# Altium project Power-Monitor.PrjPcb
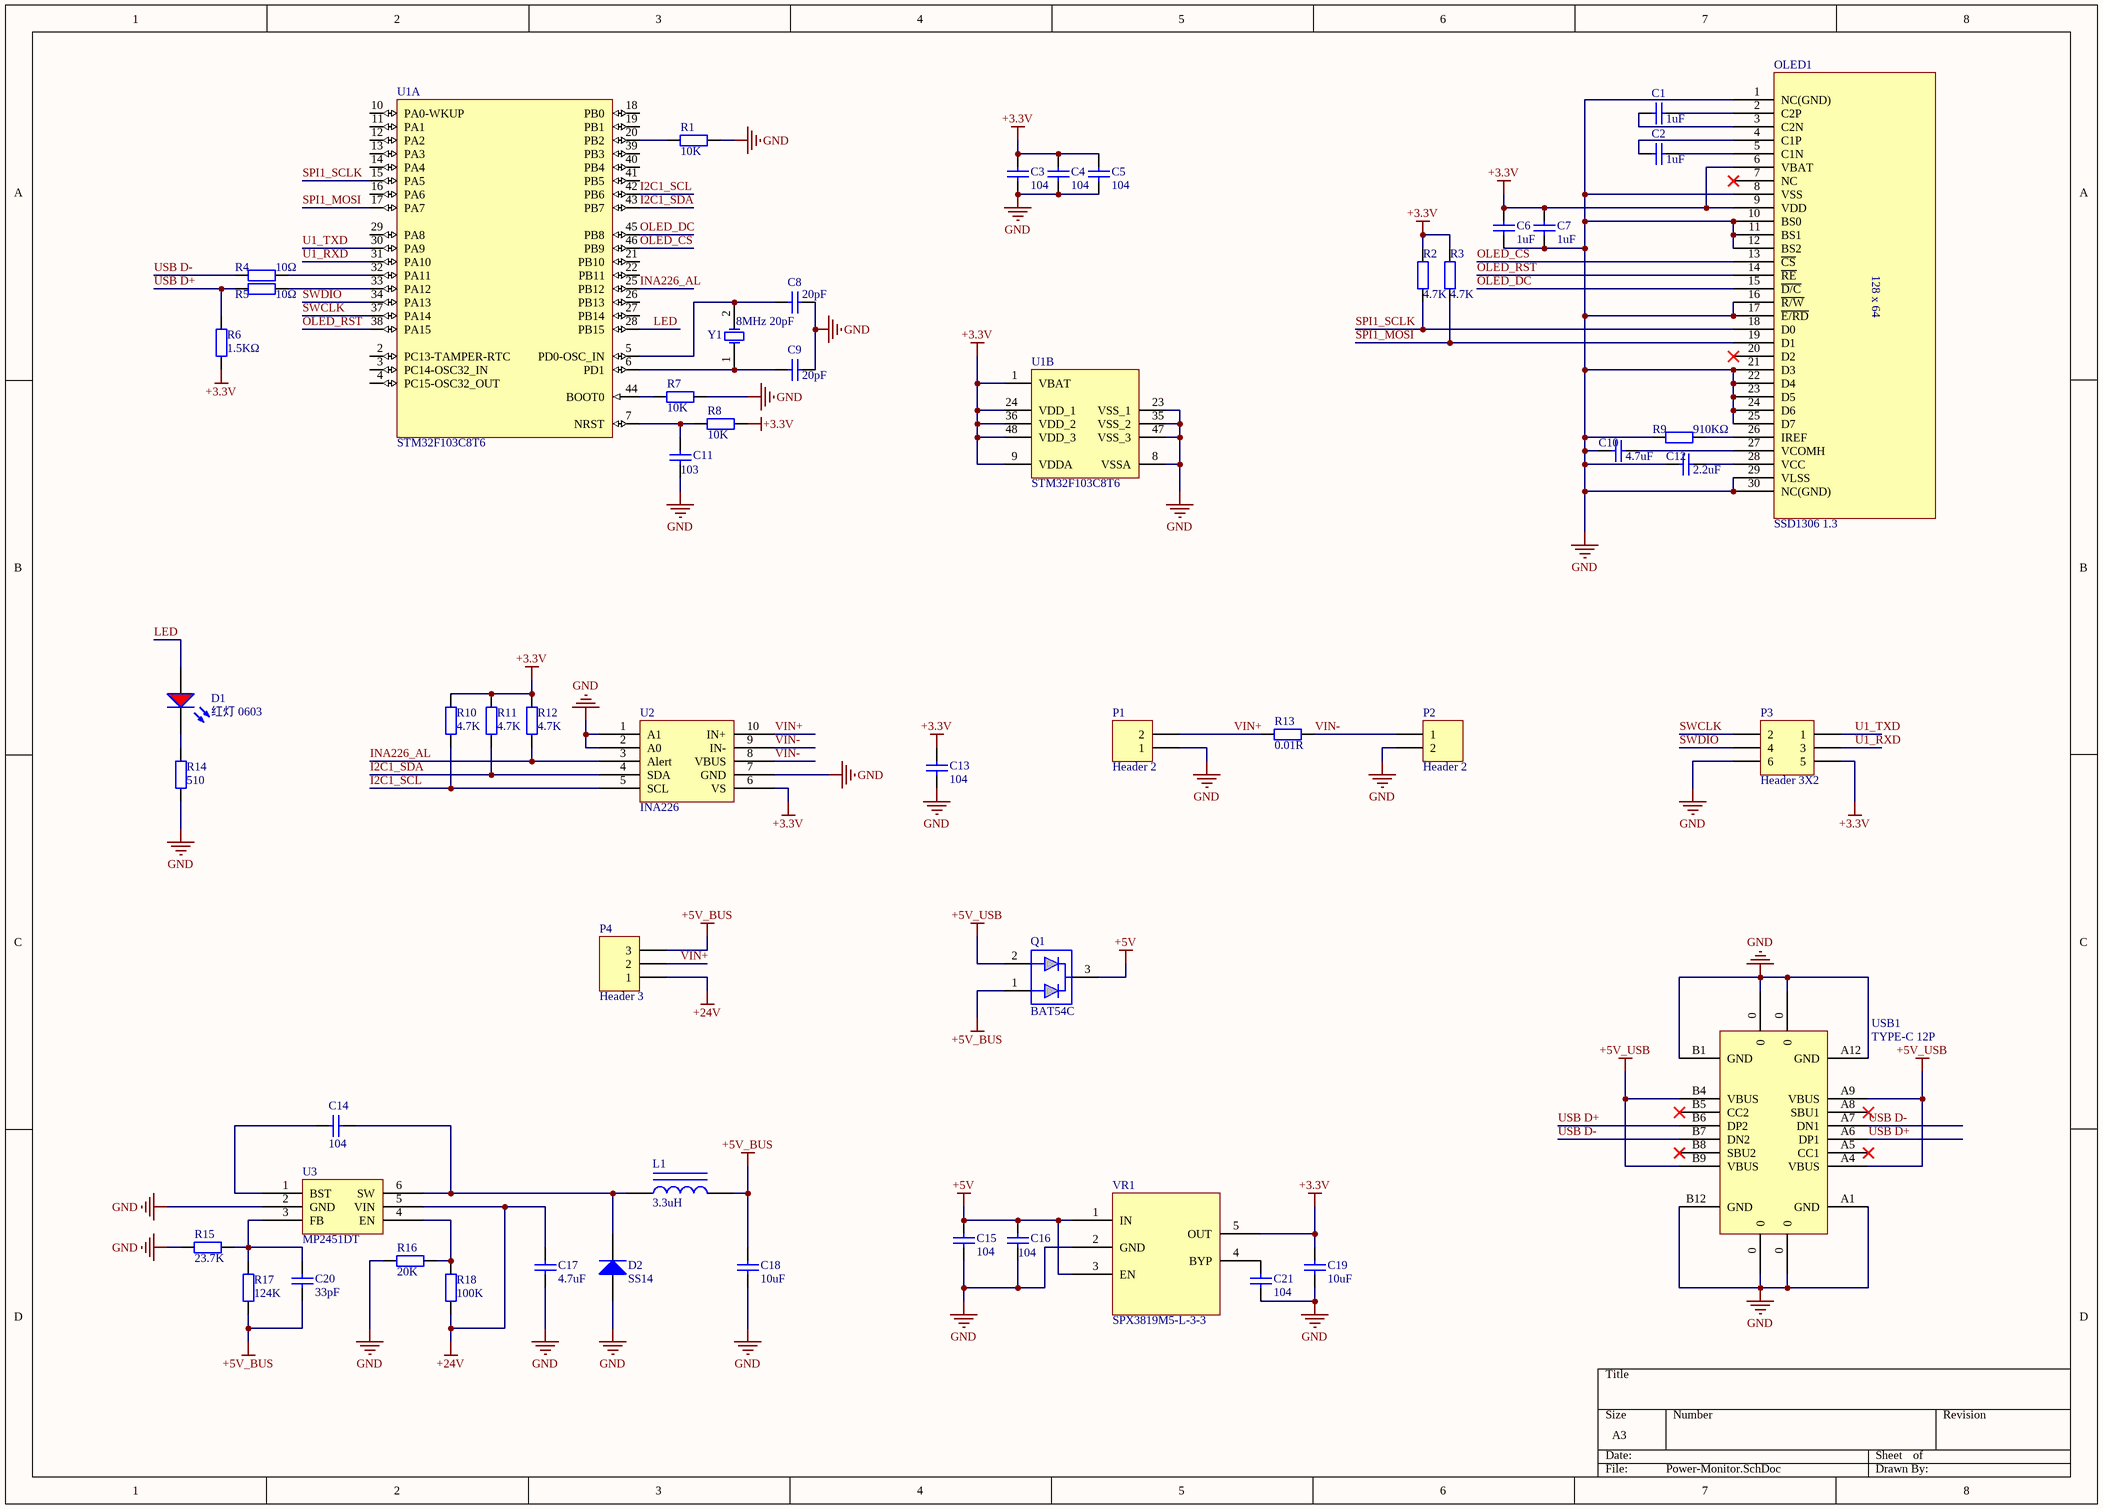
[diagram p0: Power-Monitor.SchDoc]
1 sheet, 54 parts. Net scope: global (net labels, ports and power ports of the same name join across sheets).
Board file: Power-Monitor.PcbDoc

## Sheet Power-Monitor.SchDoc
size A3

### Parts
C1  1uF  [0603_C]
C2  1uF  [0603_C]
C3  104  [0603_C]
C4  104  [0603_C]
C5  104  [0603_C]
C6  1uF  [0603_C]
C7  1uF  [0603_C]
C8  20pF  [0603_C]
C9  20pF  [0603_C]
C10  4.7uF  [0603_C]
C11  103  [0603_C]
C12  2.2uF  [0603_C]
C13  104  [0603_C]
C14  104  [0603_C]
C15  104  [0603_C]
C16  104  [0603_C]
C17  4.7uF  [1206_C]
C18  10uF  [0603_C]
C19  10uF  [0603_C]
C20  33pF  [0603_C]
C21  104  [0603_C]
D1  红灯 0603  [0603_LED_S1]
D2  SS14  [SMA(DO-214AC)_S1]
L1  3.3uH  [SMD,4.6x4.1x2.0mm]
OLED1  SSD1306 1.3  [SSD1306 1.3']
P1  Header 2  [CDS-508H-2P]
P2  Header 2  [CDS-508H-2P]
P3  Header 3X2  [201S2X3]
P4  Header 3  [HDR1X3]
Q1  BAT54C  [SOT-23(SOT-23-3)]
R1  10K  [0603_R]
R2  4.7K  [0603_R]
R3  4.7K  [0603_R]
R4  10Ω  [0603_R]
R5  10Ω  [0603_R]
R6  1.5KΩ  [0603_R]
R7  10K  [0603_R]
R8  10K  [0603_R]
R9  910KΩ  [0603_R]
R10  4.7K  [0603_R]
R11  4.7K  [0603_R]
R12  4.7K  [0603_R]
R13  0.01R  [2512_R]
R14  510  [0603_R]
R15  23.7K  [0603_R]
R16  20K  [0603_R]
R17  124K  [0603_R]
R18  100K  [0603_R]
U1  STM32F103C8T6  [LQFP-48_7x7x05P]  (parts A,B of 2)
U2  INA226  [VSSOP-10]
U3  MP2451DT  [SOT-23-6]
USB1  TYPE-C 12P  [TYPE-C 12P 贴片]
VR1  SPX3819M5-L-3-3  [SOT-23-5]
Y1  8MHz 20pF  [SMD-5032_2P]

### Nets
+3.3V: C3.2 C4.2 C5.2 C6.2 C7.2 C13.2 C19.1 OLED1.6(VBAT) OLED1.9(VDD) P3.5 R2.1 R3.1 R6.1 R8.1 R10.1 R11.1 R12.1 U1.1(VBAT) U1.9(VDDA) U1.24(VDD_1) U1.36(VDD_2) U1.48(VDD_3) U2.6(VS) VR1.5(OUT)
+5V: C15.2 C16.2 Q1.3(COM_CATHODE) VR1.1(IN) VR1.3(EN)
+5V_BUS: C18.2 C20.1 L1.2 P4.3 Q1.1(DIODE1) R17.2
+5V_USB: Q1.2(DIODE2) USB1.A4(VBUS) USB1.A9(VBUS) USB1.B4(VBUS) USB1.B9(VBUS)
+24V: C17.2 P4.1 R18.2 U3.5(VIN)
GND: C3.1 C4.1 C5.1 C6.1 C7.1 C8.2 C9.2 C10.2 C11.2 C12.2 C13.1 C15.1 C16.1 C17.1 C18.1 C19.2 C21.2 D2.1(A) OLED1.1(NC(GND)) OLED1.8(VSS) OLED1.10(BS0) OLED1.11(BS1) OLED1.12(BS2) OLED1.16(~{R/W}) OLED1.17(~{E/RD}) OLED1.21(D3) OLED1.22(D4) OLED1.23(D5) OLED1.24(D6) OLED1.25(D7) OLED1.29(VLSS) OLED1.30(NC(GND)) P1.1 P2.2 P3.6 R1.1 R7.1 R9.1 R14.1 R15.1 R16.1 U1.8(VSSA) U1.23(VSS_1) U1.35(VSS_2) U1.47(VSS_3) U2.1(A1) U2.2(A0) U2.7(GND) U3.2(GND) USB1.0 USB1.A1(GND) USB1.A12(GND) USB1.B1(GND) USB1.B12(GND) VR1.2(GND)
I2C1_SCL: R10.2 U1.42(PB6) U2.5(SCL)
I2C1_SDA: R11.2 U1.43(PB7) U2.4(SDA)
INA226_AL: R12.2 U1.25(PB12) U2.3(Alert)
LED: D1.A U1.28(PB15)
OLED_CS: OLED1.13(~{CS}) U1.46(PB9)
OLED_DC: OLED1.15(~{D/C}) U1.45(PB8)
OLED_RST: OLED1.14(~{RE}) U1.38(PA15)
SPI1_MOSI: OLED1.19(D1) R3.2 U1.17(PA7)
SPI1_SCLK: OLED1.18(D0) R2.2 U1.15(PA5)
SWCLK: P3.2 U1.37(PA14)
SWDIO: P3.4 U1.34(PA13)
U1_RXD: P3.3 U1.31(PA10)
U1_TXD: P3.1 U1.30(PA9)
USB D+: R5.1 R6.2 USB1.A6(DP1) USB1.B6(DP2)
USB D-: R4.1 USB1.A7(DN1) USB1.B7(DN2)
VIN+: P1.2 P4.2 R13.2 U2.10(IN+)
VIN-: P2.1 R13.1 U2.8(VBUS) U2.9(IN-)
NetC1_1: C1.1 OLED1.3(C2N)
NetC1_2: C1.2 OLED1.2(C2P)
NetC2_1: C2.1 OLED1.4(C1P)
NetC2_2: C2.2 OLED1.5(C1N)
NetC8_1: C8.1 U1.5(PD0-OSC_IN) Y1.2(OSC2)
NetC9_1: C9.1 U1.6(PD1) Y1.1(OSC1)
NetC10_1: C10.1 OLED1.27(VCOMH)
NetC11_1: C11.1 R8.2 U1.7(NRST)
NetC12_1: C12.1 OLED1.28(VCC)
NetC14_1: C14.1 U3.1(BST)
NetC14_2: C14.2 D2.2(K) L1.1 U3.6(SW)
NetC20_2: C20.2 R15.2 R17.1 U3.3(FB)
NetC21_1: C21.1 VR1.4(BYP)
NetD1_K: D1.K R14.2
NetOLED1_26: OLED1.26(IREF) R9.2
NetR1_2: R1.2 U1.20(PB2)
NetR4_2: R4.2 U1.32(PA11)
NetR5_2: R5.2 U1.33(PA12)
NetR7_2: R7.2 U1.44(BOOT0)
NetR16_2: R16.2 R18.1 U3.4(EN)

Not connected (* = marked no-connect by the designer): OLED1 7(NC)* 20(D2)*; U1 2(PC13-TAMPER-RTC) 3(PC14-OSC32_IN) 4(PC15-OSC32_OUT) 10(PA0-WKUP) 11(PA1) 12(PA2) 13(PA3) 14(PA4) 16(PA6) 18(PB0) 19(PB1) 21(PB10) 22(PB11) 26(PB13) 27(PB14) 29(PA8) 39(PB3) 40(PB4) 41(PB5); USB1 A5(CC1)* A8(SBU1)* B5(CC2)* B8(SBU2)*

### Notes on the sheet
- (in symbol SSD1306 1.3) 128 x 64

### Library data of the parts
C1-C10 C12-C21 = 0603 2.7pF (2R7) 0.25pF 50V: 贴片电容; ComponentLink1Description: 供应商链接; ComponentLink1URL: http://www.szlcsc.com/product/details_16831.html; Package: 0603; Supplier: LC; SuppliersPartNumber: C16149
C11 = Cap: Capacitor; Published: 8-Jun-2000; LatestRevisionDate: 17-Jul-2002; LatestRevisionNote: Re-released for DXP Platform.; PackageReference: RAD-0.3; Publisher: Altium Limited; Value: 103
D1 = 0805 红灯: 发光二极管; ComponentLink1Description: 供应商链接; ComponentLink1URL: http://www.szlcsc.com/product/details_2668.html; Package: 0805; Supplier: LC; SuppliersPartNumber: C2295
D2 = SMA(DO-214AC) SS54: 二极管; ComponentLink1Description: 供应商链接; ComponentLink1URL: http://www.szlcsc.com/product/details_23178.html; Package: SMA(DO-214AC); Supplier: LC; SuppliersPartNumber: C22452
L1 = 电感: 贴片电感
P1 P2 = Header 2: Header, 2-Pin; LatestRevisionDate: 17-Jul-2002; LatestRevisionNote: Re-released for DXP Platform.; Publisher: Altium Limited
P3 = Header 3X2: Header, 3-Pin, Dual row; LatestRevisionDate: 17-Jul-2002; LatestRevisionNote: Re-released for DXP Platform.; Publisher: Altium Limited
P4 = Header 3: Header, 3-Pin; LatestRevisionDate: 17-Jul-2002; LatestRevisionNote: Re-released for DXP Platform.; Publisher: Altium Limited
Q1 = BAT54C: BAT54C/KL3
R1-R3 R7 R8 R10-R13 R15-R18 = Res2: Resistor; Published: 8-Jun-2000; LatestRevisionDate: 17-Jul-2002; LatestRevisionNote: Re-released for DXP Platform.; PackageReference: AXIAL-0.4; Publisher: Altium Limited
  R1 R7 R8: Value: 10K
  R2 R3 R10-R12: Value: 4.7K
  R13: Value: 0.01R
  R15: Value: 23.7K
  R16: Value: 20K
  R17: Value: 124K
  R18: Value: 100K
R4-R6 R9 R14 = 0603 330Ω (3300) 1%: 贴片电阻; ComponentLink1Description: 供应商链接; ComponentLink1URL: http://www.szlcsc.com/product/details_23865.html; Package: 0603; Supplier: LC; SuppliersPartNumber: C23138
U1 = STM32F103C8T6: ARM; ComponentLink1Description: 供应商链接; ComponentLink1URL: http://www.szlcsc.com/product/details_9243.html; Package: LQFP-48_7x7x05P; Supplier: LC; SuppliersPartNumber: C8734
U3 = MP2451DT: DCDC  36V 0.6A
Y1 = SMD-5032_2P 8MHz 20ppm 20pF: 贴片晶振; ComponentLink1Description: 供应商链接; ComponentLink1URL: http://www.szlcsc.com/product/details_117214.html; Package: SMD-5032_2P; Supplier: LC; SuppliersPartNumber: C115962